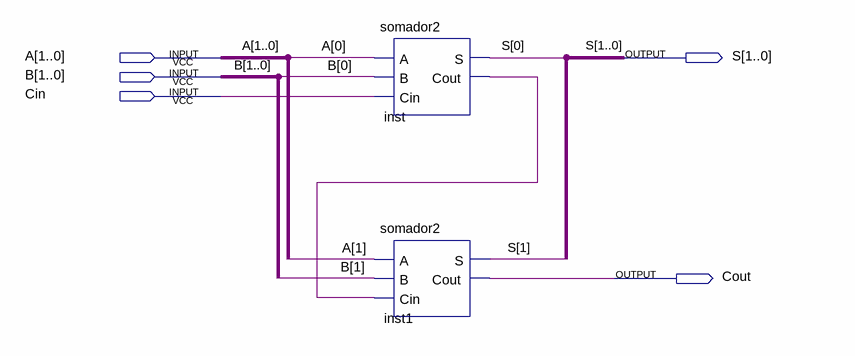
[diagram p0: schematic sheet]
// Quartus schematic somador4.bdf as structural Verilog: 2 symbols, 5 pins
module somador4 (
  input  [1:0] A,
  input  [1:0] B,
  input  Cin,
  output [1:0] S,
  output Cout
);

  wire inst_cout;

  somador2 inst (.A(A[0]), .B(B[0]), .Cin(Cin), .S(S[0]), .Cout(inst_cout));
  somador2 inst1 (.A(A[1]), .B(B[1]), .Cin(inst_cout), .S(S[1]), .Cout(Cout));
endmodule
